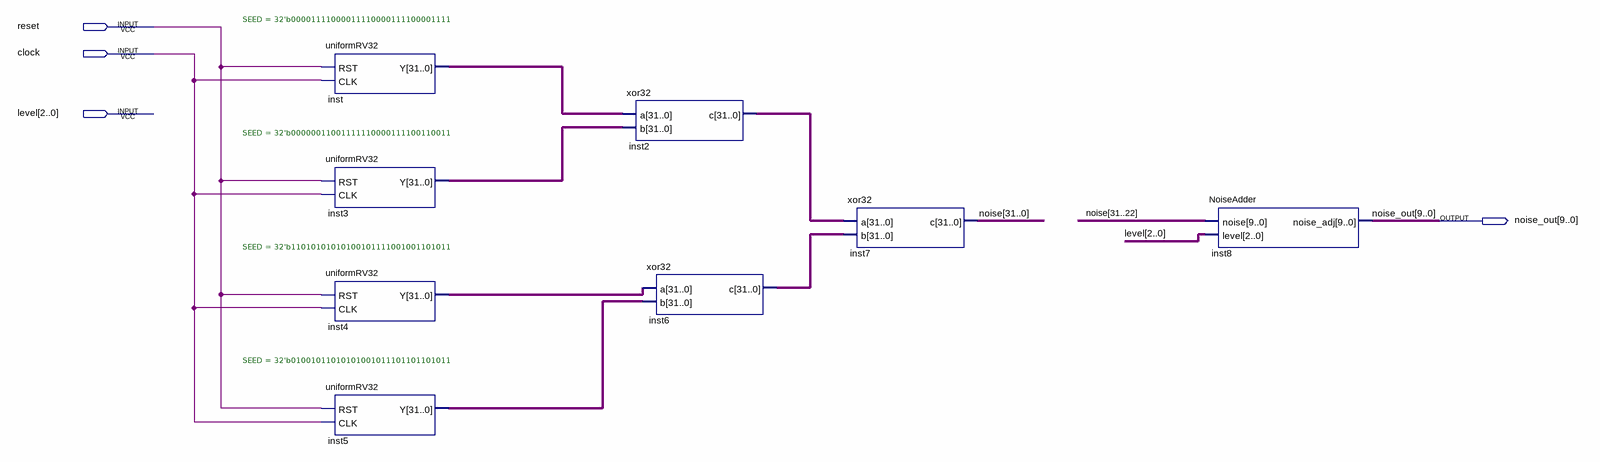
[diagram p0: schematic sheet]
// Quartus schematic noise-generator.bdf as structural Verilog: 8 symbols, 4 pins
module \noise-generator  (
  input  reset,
  input  clock,
  input  [2:0] level,
  output [9:0] noise_out
);

  wire [31:0] inst2_c, inst3_y, inst4_y, inst5_y, inst6_c, inst_y, noise;

  uniformRV32 #(.SEED(32'b00001111000011110000111100001111)) inst (.RST(reset), .CLK(clock), .Y(inst_y));
  uniformRV32 #(.SEED(32'b00000011001111110000111100110011)) inst3 (.RST(reset), .CLK(clock), .Y(inst3_y));
  uniformRV32 #(.SEED(32'b11010101010100101111001001101011)) inst4 (.RST(reset), .CLK(clock), .Y(inst4_y));
  uniformRV32 #(.SEED(32'b01001011010101001011101101101011)) inst5 (.RST(reset), .CLK(clock), .Y(inst5_y));
  xor32 inst2 (.a(inst_y), .b(inst3_y), .c(inst2_c));
  xor32 inst6 (.a(inst4_y), .b(inst5_y), .c(inst6_c));
  xor32 inst7 (.a(inst2_c), .b(inst6_c), .c(noise));
  NoiseAdder inst8 (.noise(noise[31:22]), .level(level), .noise_adj(noise_out));
endmodule
